# EAGLE schematic HM-RC-8_Remote-v01-001 (EAGLE 9.3.0)
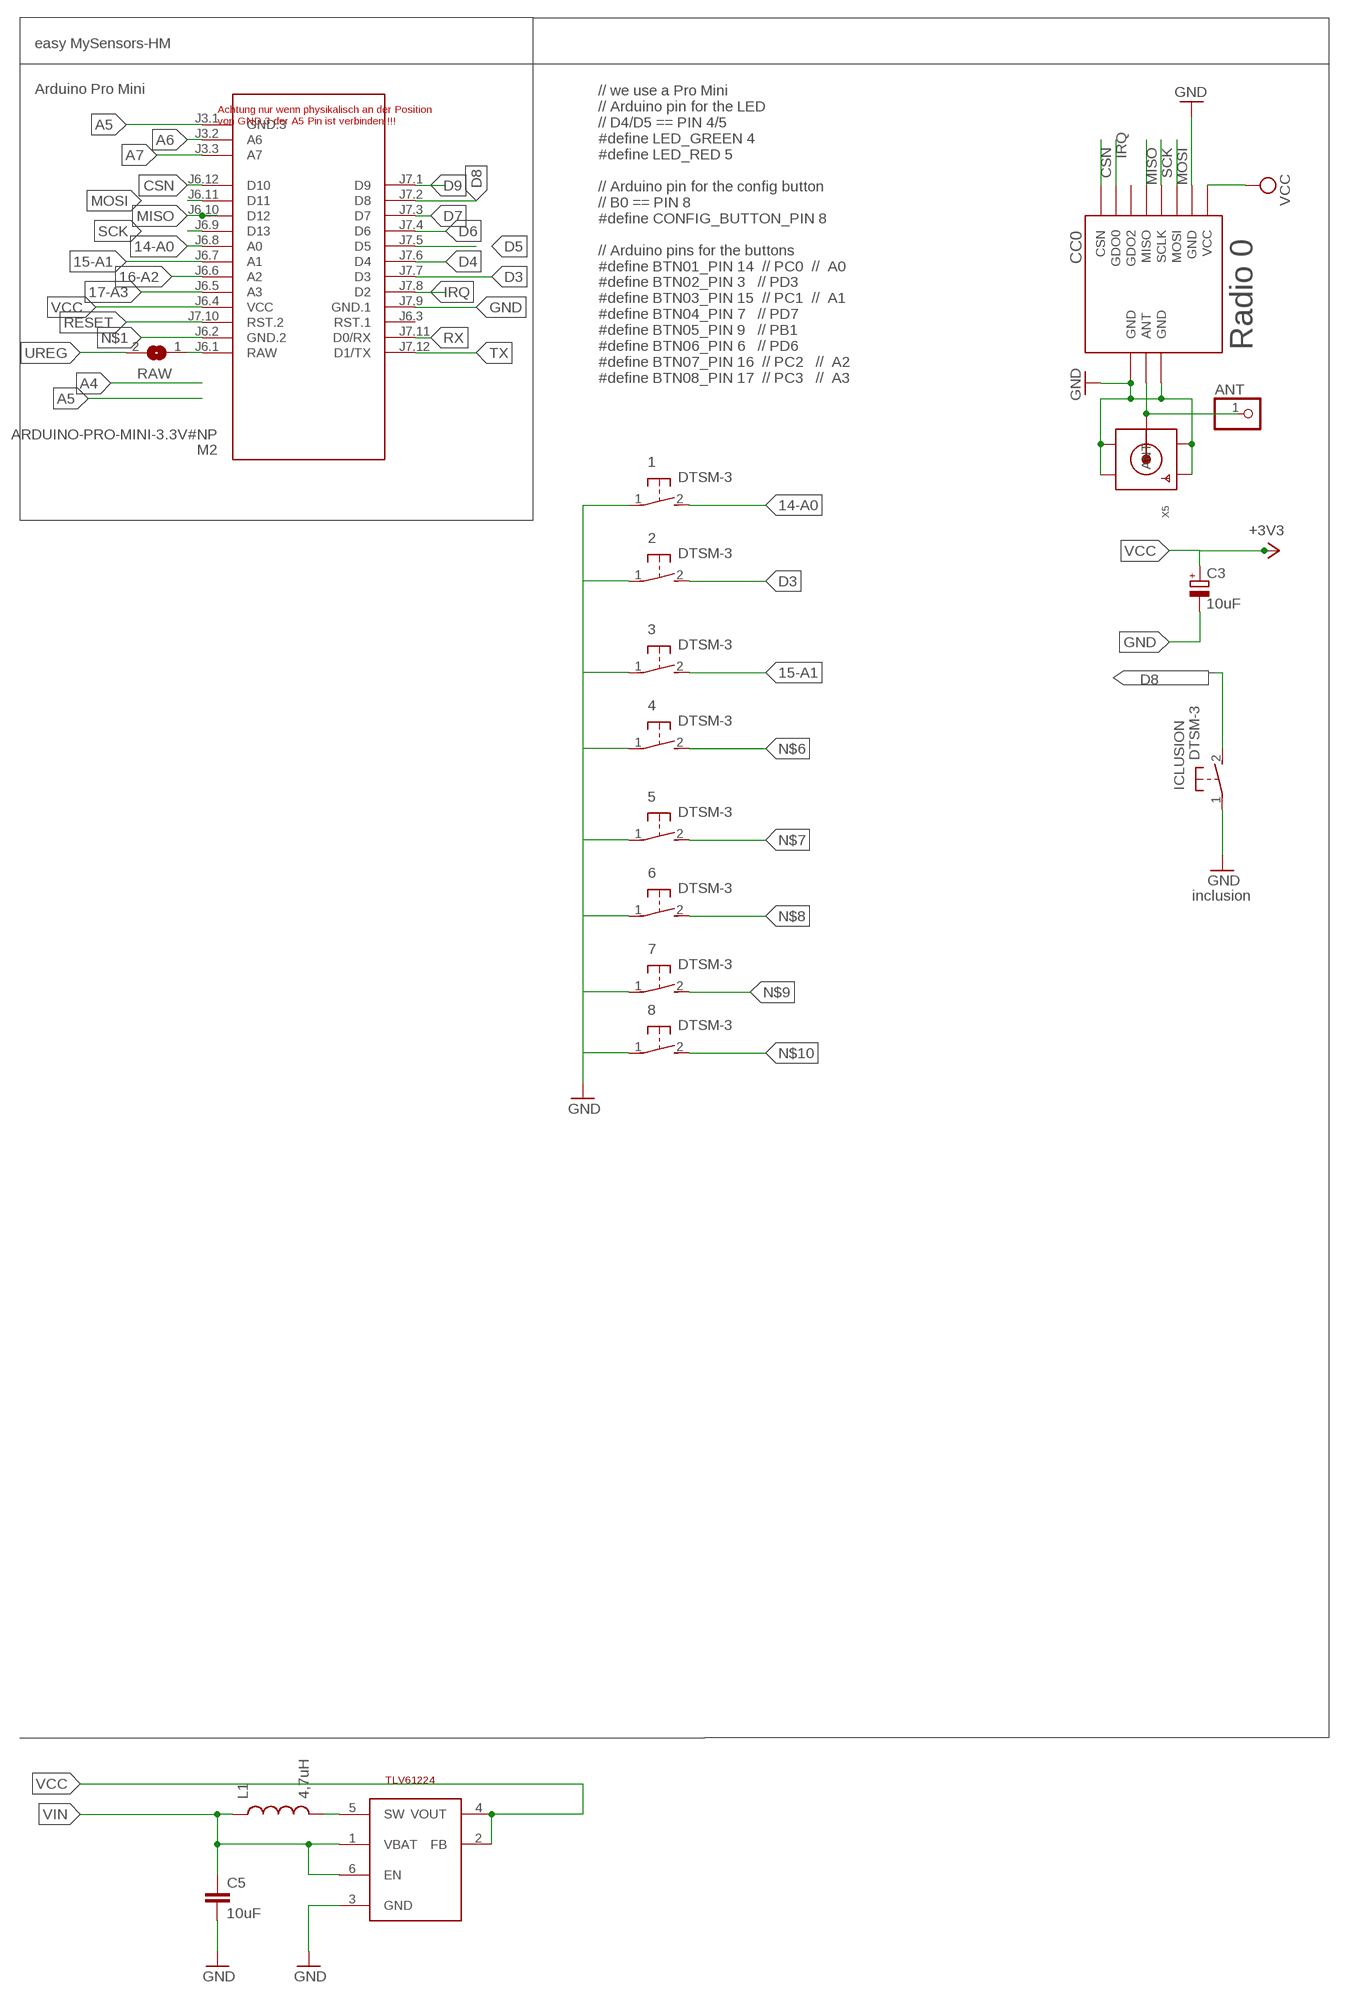
[diagram p0: schematic, sheet 1]

## Parts
1  DTSM-3  [DTSM-3]
2  DTSM-3  [DTSM-3]
3  DTSM-3  [DTSM-3]
4  DTSM-3  [DTSM-3]
5  DTSM-3  [DTSM-3]
6  DTSM-3  [DTSM-3]
7  DTSM-3  [DTSM-3]
8  DTSM-3  [DTSM-3]
ANT  PINHD-1X1  [1X01]
C3  10uF  CPOL-EUSMCC  [SMC_C]
C5  10uF  CAP0805  [0805]
CC0  CC1101  CC1101_MODULE1SMD  [CC1101_MODULE1_SMD]
ICLUSION  DTSM-3  [DTSM-3]
L1  4,7uH  INDUCTOR0805  [0805]
M2  ARDUINO-PRO-MINI-3.3V#NP  [ARDUINO-PRO-MINI#NP]
RAW  SJ  [SJ]
STEPUP  TLV61224  TI-TLV61224  [SOT23-6L]
X5  SMACONNECTOR_EDGE  [SMA_EDGELAUNCH]

## Nets
14-A0: 1.2 M2.J6.8(A0)
15-A1: 3.2 M2.J6.7(A1)
16-A2: M2.J6.6(A2)
17-A3: M2.J6.5(A3)
A5: M2.J3.1(GND.3)
A6: M2.J3.2(A6)
A7: M2.J3.3(A7)
ANT0: ANT.1 CC0.ANT X5.P(ANT)
CSN: CC0.CSN M2.J6.12(D10)
D3: 2.2 M2.J7.7(D3)
D4: M2.J7.6(D4)
D5: M2.J7.5(D5)
D6: M2.J7.4(D6)
D7: M2.J7.3(D7)
D8: ICLUSION.2 M2.J7.2(D8)
D9: M2.J7.1(D9)
GND [Power]: 1.1 3.1 4.1 5.1 6.1 7.1 8.1 C3.- C5.2 CC0.GND@0(GND) CC0.GND@1(GND) CC0.GND@2(GND) ICLUSION.1 M2.J7.9(GND.1) STEPUP.3(GND) X5.GND@1(GND4) X5.GND@2(GND3) X5.GND@3(GND2) X5.GND@4(GND1)
IRQ: CC0.GDO0 M2.J7.8(D2)
MISO: CC0.MISO M2.J6.10(D12)
MOSI: CC0.MOSI M2.J6.11(D11)
N$1 [Power]: M2.J6.2(GND.2)
N$2: 2.1
N$6: 4.2
N$7: 5.2
N$8: 6.2
N$9: 7.2
N$10: 8.2
N$13: L1.2 STEPUP.5(SW)
RAW [Power]: M2.J6.1(RAW) RAW.1
RESET: M2.J7.10(RST.2)
RX: M2.J7.11(D0/RX)
SCK: CC0.SCLK M2.J6.9(D13)
TX: M2.J7.12(D1/TX)
UREG [Power]: RAW.2
VCC [Power]: C3.+ CC0.VCC M2.J6.4(VCC) STEPUP.2(FB) STEPUP.4(VOUT) ; supply symbol labelled +3V3
VIN: C5.1 L1.1 STEPUP.1(VBAT) STEPUP.6(EN)
Unconnected: CC0.GDO2 M2.J6.3(RST.1)

## Notes on the sheet
- easy MySensors-HM
- Arduino Pro Mini
- Achtung nur wenn physikalisch an der Position 
  von GND.3 der A5 Pin ist verbinden !!!
- Radio 0
- // we use a Pro Mini
  // Arduino pin for the LED
  // D4/D5 == PIN 4/5
  #define LED_GREEN 4
  #define LED_RED 5
  
  // Arduino pin for the config button
  // B0 == PIN 8
  #define CONFIG_BUTTON_PIN 8
  
  // Arduino pins for the buttons
  #define BTN01_PIN 14  // PC0  //  A0
  #define BTN02_PIN 3   // PD3  
  #define BTN03_PIN 15  // PC1  //  A1
  #define BTN04_PIN 7   // PD7
  #define BTN05_PIN 9   // PB1
  #define BTN06_PIN 6   // PD6
  #define BTN07_PIN 16  // PC2   //  A2
  #define BTN08_PIN 17  // PC3   //  A3
- inclusion

## Library data of the parts
1-8 ICLUSION = mechanics:DTSM-3: Diptronics SMD button 6x3.5 mm
ANT = pinhead:PINHD-1X1: PIN HEADER
C3 = rcl:CPOL-EU: POLARIZED CAPACITOR, European symbol; SPICEPREFIX: C
C5 = SparkFun-Passives:CAP: Capacitor Standard 0603 ceramic capacitor, and 0.1" leaded capacitor.
CC0 = wireless:CC1101_MODULE1: CC1101 wireless module for 433/868 MHz (sold from Aliexpress). DIL version for mounting with pin header (and SMD soldering) and SMD only variant available.
L1 = SparkFun-Passives:INDUCTOR: Inductors Basic Inductor/Choke - 0603 and 1206. Footprints are not proven and vary greatly between part numbers.
M2 = diy-modules-Martin:ARDUINO-PRO-MINI-*#NP: Arduino Pro Mini (and compatible devices) without programming pads More details available here: https://www.arduino.cc/en/Main/ArduinoBoardProMini Click here to find device on ebay.com <http://www.ebay.com/sch/arduino+pro+mini>
RAW = jumper:SJ: SMD solder JUMPER
STEPUP = TLV61224:TI-TLV61224
X5 = adafruit:SMACONNECTOR: SMA Connector 90° DIP SMA Connector, 50 Ohm (4UConnector: 07259)

## Net classes
0 default: width 0.305 mm
1 Power: width 0.508 mm